# EAGLE design Horn Board Rev 1 (EAGLE 8.3.2)
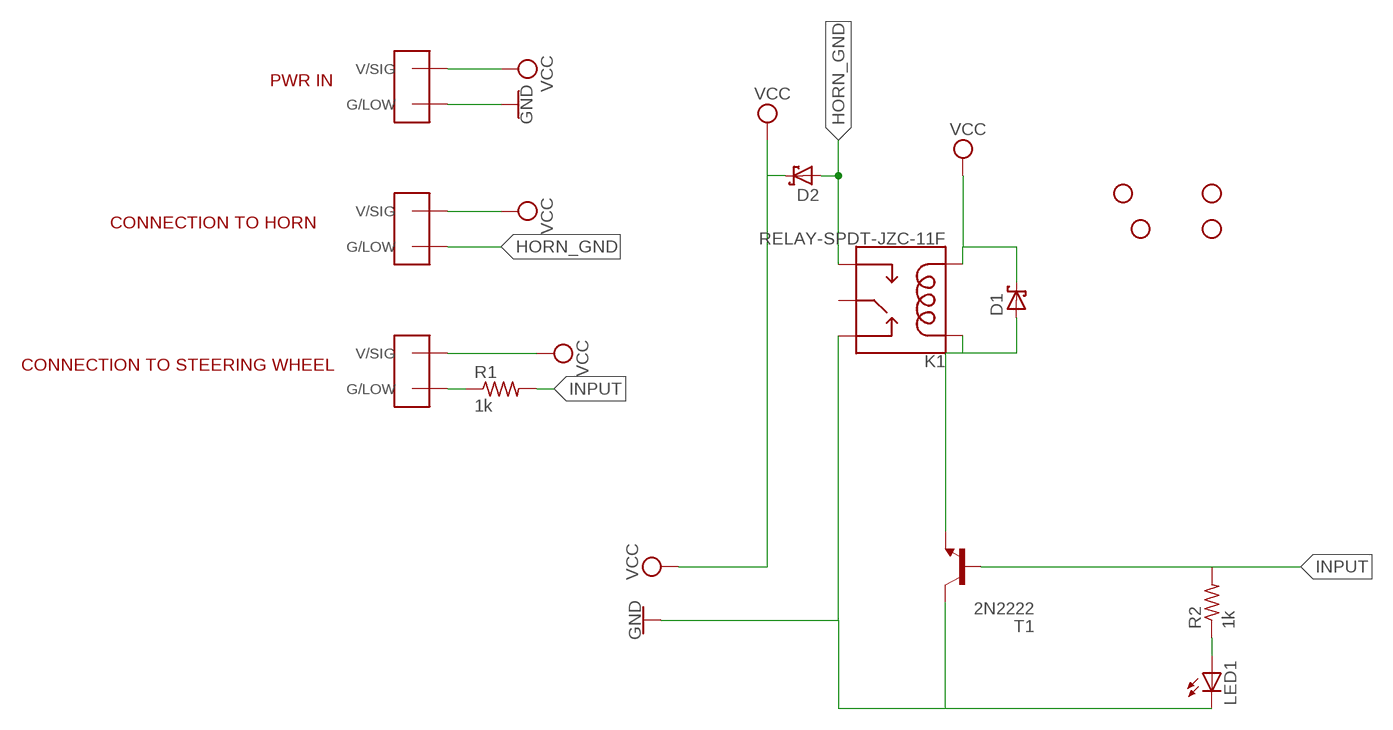
[diagram p0: schematic, sheet 1]

## Parts
D1  SCHOTTKY-DIODEAG  [AG]
D2  SCHOTTKY-DIODEAG  [AG]
H1  STAND-OFF  [STAND-OFF]
H2  STAND-OFF  [STAND-OFF]
H3  STAND-OFF  [STAND-OFF]
H4  STAND-OFF  [STAND-OFF]
K1  RELAY-SPDT-JZC-11F  [RELAY-JZC]
LED1  LED  [SMARTLED-TTW]
R1  1k  R-US_0204/2V  [0204V]
R2  1k  R-US_0204/2V  [0204V]
T1  2N2222  [TO92-EBC-OVAL]
U$1  TE770966  [2X1-MATE-N-LOCK]
U$2  TE770966  [2X1-MATE-N-LOCK]
U$8  TE770966  [2X1-MATE-N-LOCK]

## Nets
GND: K1.2(NC) LED1.C@1(C) T1.C U$8.CIRCUIT2(G/LOW)
HORN_GND: D2.A K1.3(NO) U$1.CIRCUIT2(G/LOW)
INPUT: R1.2 R2.2 T1.B
N$1: R1.1 U$2.CIRCUIT2(G/LOW)
N$2: D1.A K1.5(COIL1) T1.E
N$5: LED1.A@1(A) R2.1
VCC: D1.C D2.C K1.1(COIL2) U$1.CIRCUIT1(V/SIG) U$2.CIRCUIT1(V/SIG) U$8.CIRCUIT1(V/SIG)
Unconnected: K1.4(MAIN)

## Notes on the sheet
- PWR IN
- CONNECTION TO HORN
- CONNECTION TO STEERING WHEEL

## Library data of the parts
D1 D2 = adafruit:SCHOTTKY-DIODE: Schottky Diode
H1-H4 = SparkFun-Hardware:STAND-OFF: Stand Off Drill holes for mechanically mounting via screws, standoffs, etc. Note: Use the keepout ring to avoid running the screw head into surrounding components. Variant Overviews STAND-OFF - Mechanical footprint for a #4 phillips button head screw. STAND-OFF-TIGHT - Mechanical footprint for a #4 phillips button head screw, Example SparkFun Products Screw - Phillips Head (1/4", 4-40, 10 pack) <https://www.sparkfun.com/products/10453> (PRT-10453) Screw - Phillips Head (1/2", 4-40, 10 pack) <https://www.sparkfun.com/products/10452> (PRT-10452) Screw - Phillips Head (3/4", 4-40, 10 pack) <https://www.sparkfun.com/products/10451> (PRT-10451) Screw - Phillips Head (1", 4-40, 10 pack) <https://www.sparkfun.com/products/10450> (PRT-10450)
K1 = SparkFun-Electromechanical:RELAY-SPDT: SPDT Electromechanical Relay Single-pole, double-throw sealed relays. When current is applied to the coil, it throws a simple changeover switch, terminating the connection from the NC contact to ground and closing the NO contact. Use them to switch high voltage/high current devices. SparkFun Products JQX-15F: Relay SPDT Sealed - 20A <https://www.sparkfun.com/products/10924> (COM-10924) JZC-11F: Relay SPDT Sealed <https://www.sparkfun.com/products/100> (COM-00100); PROD_ID: COMP-09533; SF_SKU: COM-00100
LED1 = adafruit:LED: LED OSRAM: - CHIPLED LG R971, LG N971, LY N971, LG Q971, LY Q971, LO R971, LY R971 LH N974, LH R974 LS Q976, LO Q976, LY Q976 LO Q996 - Hyper CHIPLED LW Q18S LB Q993, LB Q99A, LB R99A - SideLED LS A670, LO A670, LY A670, LG A670, LP A670 LB A673, LV A673, LT A673, LW A673 LH A674 LY A675 LS A676, LA A676, LO A676, LY A676, LW A676 LS A679, LY A679, LG A679 - Hyper Micro SIDELED® LS Y876, LA Y876, LO Y876, LY Y876 LT Y87S - SmartLED LW L88C, LW L88S LB L89C, LB L89S, LG L890 LS L89K, LO L89K, LY L89K LS L896, LA L896, LO L896, LY L896 - TOPLED LS T670, LO T670, LY T670, LG T670, LP T670 LSG T670, LSP T670, LSY T670, LOP T670, LYG T670 LG T671, LOG T671, LSG T671 LB T673, LV T673, LT T673, LW T673 LH T674 LS T676, LA T676, LO T676, LY T676, LB T676, LH T676, LSB T676, LW T676 LB T67C, LV T67C, LT T67C, LS T67K, LO T67K, LY T67K, LW E67C LS E67B, LA E67B, LO E67B, LY E67B, LB E67C, LV E67C, LT E67C LW T67C LS T679, LY T679, LG T679 LS T770, LO T770, LY T770, LG T770, LP T770 LB T773, LV T773, LT T773, LW T773 LH T774 LS E675, LA E675, LY E675, LS T675 LS T776, LA T776, LO T776, LY T776, LB T776 LHGB T686 LT T68C, LB T68C - Hyper Mini TOPLED® LB M676 - Mini TOPLED Santana® LG M470 LS M47K, LO M47K, LY M47K Source: http://www.osram.convergy.de/
R1 R2 = adafruit:R-US_: RESISTOR, American symbol
T1 = adafruit:2N2222: NPN TRANSISTOR Big oval pads
U$1 U$2 U$8 = Shell2013(1):TE770966

## Board
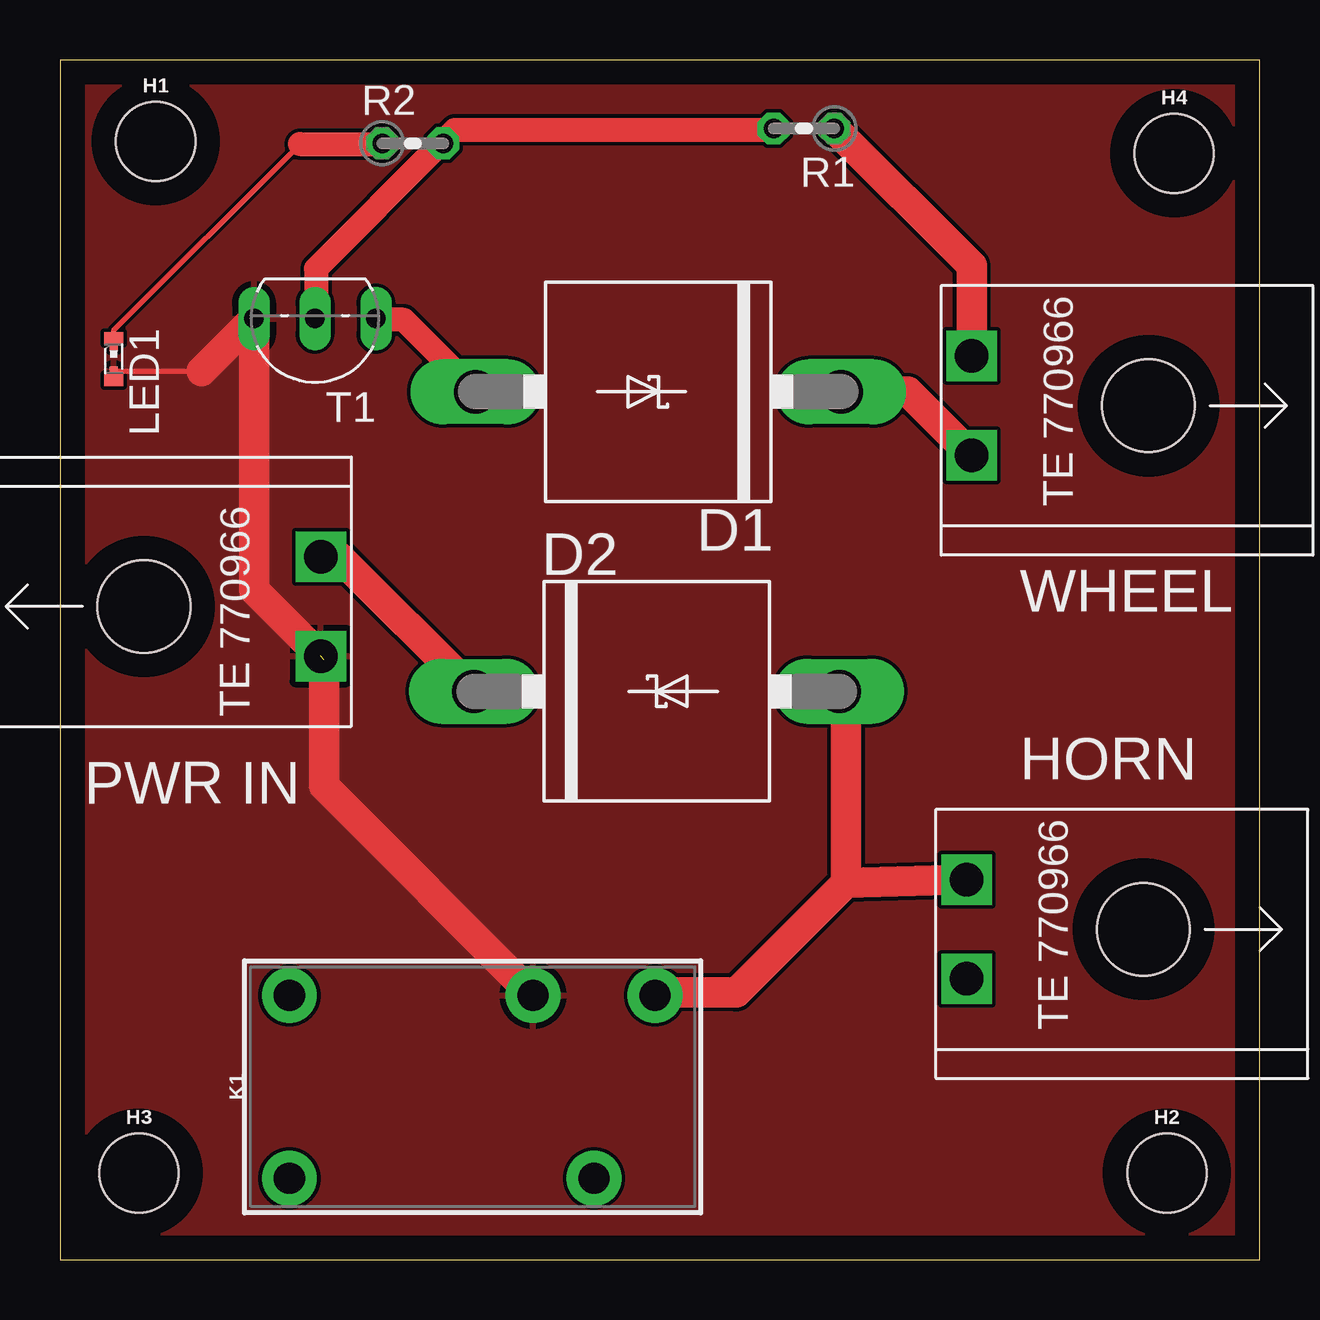
[diagram p1: board, top side]
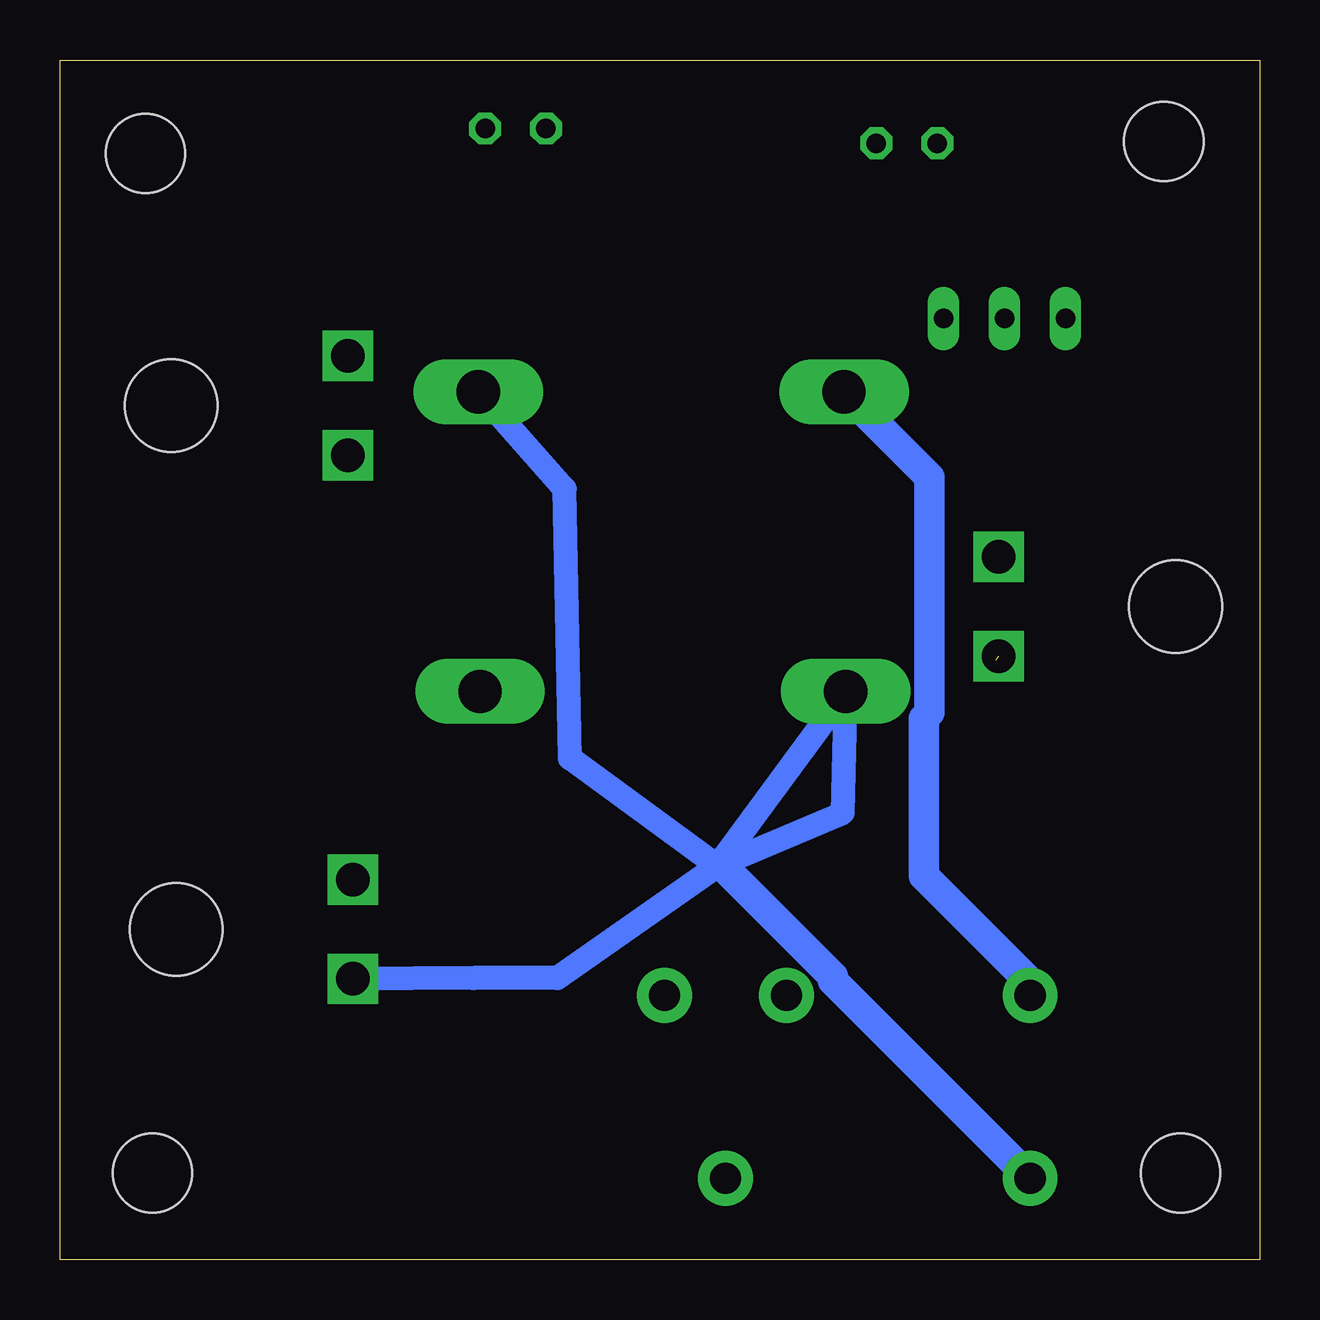
[diagram p2: board, bottom side, seen from below]

Size 50 x 50 mm. Coordinates in mm from the lower left corner, seen from the top.
Outline: 0,0 50,0 50,50 0,50 0,0
Copper layers (1*16): Top 0.035mm / dielectric 1.5mm / Bottom 0.035mm
Design rules "default": minimum track width 6mil, minimum drill 0.35mm, track to track 6mil, track to pad 6mil, pad to pad 6mil, via to via 6mil, smd to smd 6mil, copper to edge 40mil, drill to drill 6mil, minimum pad ring 10mil, minimum via ring 8mil, stop-mask expansion 4mil, vias tented up to drill 0mil, thermal gap 10mil

### Footprints (pad centres in the part's own frame; a part is rotated, then mirrored left to right if it is on the bottom)
AG = drill 1.803 long: A 7.62,0; C -7.62,0
STAND-OFF = hole 3.302: 0,0
RELAY-JZC = drill 1.3 pad 2.286: 1 3.81,-8.89; 2 -3.81,1.27; 3 -3.81,6.35; 4 3.81,3.81; 5 -3.81,-8.89
SMARTLED-TTW = smd 0.8 x 0.5: A 0,-0.875; C 0,0.875 | smd 0.35 x 0.35: A@1 0,-0.5; C@1 0,0.5
0204V = drill 0.813 octagon: 1 -1.27,0; 2 1.27,0
TO92-EBC-OVAL = drill 0.813 long: B 0,-1.27; C 2.54,-1.27; E -2.54,-1.27
2X1-MATE-N-LOCK = drill 1.4 square: CIRCUIT1 -2.07,14.23; CIRCUIT2 2.07,14.23 | hole 3.86: 0,6.86

### Placement (x,y rotation side)
D1  24.94,36.17 180 top
D2  24.87,23.68 0 top
H1  3.99,46.61 0 top
H2  46.14,3.61 0 top
H3  3.29,3.61 0 top
H4  46.44,46.11 0 top
K1  18.45,7.2 270 top
LED1  2.24,37.54 180 top
R1  31.01,47.14 180 top
R2  14.7,46.53 0 top
T1  10.63,37.95 180 top
U$1  52.02,13.77 90 top
U$2  52.23,35.59 90 top
U$8  -3.36,27.22 270 top

### Tracks (layer width: path | path; a pad name or v marks a point on that pad's centre or on a via)
GND  (1 unrouted)
  Top 0.2: LED1.C@1 5.91,37.04
  Top 1.27: K1.2 11,19.73 11,25 8.09,27.91 T1.C 5.91,37.04
  pour Top: 0,50 50,50 50,0 0,0
HORN_GND
  Top 0.152: 32.61,23.62 32.77,23.47 | 32.77,15.85 U$1.CIRCUIT2
  Top 1: 32.61,23.62 D2.A | 24.84,11.12 K1.3
  Top 1.27: 32.77,23.47 32.77,15.85 | 24.84,11.12 28.19,11.12 32.77,15.7 U$1.CIRCUIT2
INPUT
  Top 0.152: 15.85,46.48 R2.2 16,46.63
  Top 1: 15.85,46.48 10.67,41.3 10.67,39.32 T1.B | 16,46.63 16.46,47.09 29.72,47.09 R1.2
N$1
  Top 1.27: U$2.CIRCUIT2 38,41.42 R1.1
N$2
  Top 0.152: 17.22,36.27 D1.A
  Top 1: 17.22,36.27 14.33,39.17 13.26,39.17 T1.E
  Bottom 1.27: D1.A 13.76,32.61 13.76,22.79 14,22.55 14,16 9.56,11.56 K1.5
N$5
  Top 0.2: LED1.A@1 2.24,38.74 10,46.5
  Top 1: 10,46.5 13.4,46.5 R2.1
VCC
  Top 1.27: D1.C 35.35,36.17 U$2.CIRCUIT1 | D2.C 11.64,29.29 U$8.CIRCUIT1
  Bottom 1: 22.59,16.4 17.37,18.62 D2.C 22.59,16.4 | 22.59,16.4 29.26,11.73 32.77,11.73 U$1.CIRCUIT1 | 22.59,16.4 28.75,20.9 28.96,32.12 D1.C
  Bottom 1.27: K1.1 17.79,11.62 17.79,11.81 22.38,16.4 22.59,16.4

### Text on the board
tPlace: WHEEL | HORN | PWR IN